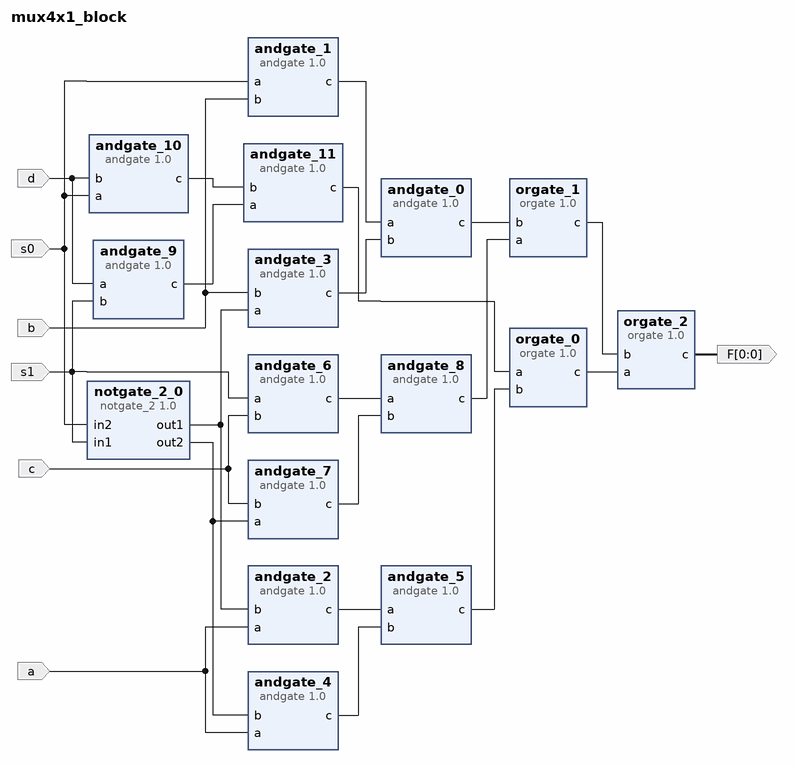
[diagram p0: block diagram of the top level]
# Vivado block design mux4x1_block, xc7a35tcpg236-1, Vivado 2018.3
create_bd_design mux4x1_block

create_bd_port -dir I s1
create_bd_port -dir I s0
create_bd_port -dir I a
create_bd_port -dir I b
create_bd_port -dir I c
create_bd_port -dir I d
create_bd_port -dir O -from 0 -to 0 F

create_bd_cell -type ip -vlnv xilinx.com:user:notgate_2:1.0 notgate_2_0
create_bd_cell -type ip -vlnv xilinx.com:user:andgate:1.0 andgate_0
create_bd_cell -type ip -vlnv xilinx.com:user:andgate:1.0 andgate_1
create_bd_cell -type ip -vlnv xilinx.com:user:andgate:1.0 andgate_2
create_bd_cell -type ip -vlnv xilinx.com:user:andgate:1.0 andgate_3
create_bd_cell -type ip -vlnv xilinx.com:user:orgate:1.0 orgate_0
create_bd_cell -type ip -vlnv xilinx.com:user:orgate:1.0 orgate_1
create_bd_cell -type ip -vlnv xilinx.com:user:andgate:1.0 andgate_4
create_bd_cell -type ip -vlnv xilinx.com:user:andgate:1.0 andgate_5
create_bd_cell -type ip -vlnv xilinx.com:user:andgate:1.0 andgate_6
create_bd_cell -type ip -vlnv xilinx.com:user:andgate:1.0 andgate_7
create_bd_cell -type ip -vlnv xilinx.com:user:andgate:1.0 andgate_8
create_bd_cell -type ip -vlnv xilinx.com:user:andgate:1.0 andgate_9
create_bd_cell -type ip -vlnv xilinx.com:user:andgate:1.0 andgate_10
create_bd_cell -type ip -vlnv xilinx.com:user:andgate:1.0 andgate_11
create_bd_cell -type ip -vlnv xilinx.com:user:orgate:1.0 orgate_2

# ---- connections ----

connect_bd_net -net s1_1 [get_bd_ports s1] [get_bd_pins notgate_2_0/in1] [get_bd_pins andgate_6/a] [get_bd_pins andgate_9/b]
connect_bd_net [get_bd_ports a] [get_bd_pins andgate_2/a] [get_bd_pins andgate_4/a]
connect_bd_net [get_bd_pins notgate_2_0/out1] [get_bd_pins andgate_2/b] [get_bd_pins andgate_3/a]
connect_bd_net [get_bd_pins notgate_2_0/out2] [get_bd_pins andgate_4/b] [get_bd_pins andgate_7/a]
connect_bd_net [get_bd_pins andgate_2/c] [get_bd_pins andgate_5/a]
connect_bd_net [get_bd_pins andgate_4/c] [get_bd_pins andgate_5/b]
connect_bd_net [get_bd_ports b] [get_bd_pins andgate_3/b] [get_bd_pins andgate_1/b]
connect_bd_net -net s0_1 [get_bd_ports s0] [get_bd_pins notgate_2_0/in2] [get_bd_pins andgate_1/a] [get_bd_pins andgate_10/a]
connect_bd_net [get_bd_pins andgate_1/c] [get_bd_pins andgate_0/a]
connect_bd_net [get_bd_pins andgate_3/c] [get_bd_pins andgate_0/b]
connect_bd_net [get_bd_ports c] [get_bd_pins andgate_7/b] [get_bd_pins andgate_6/b]
connect_bd_net [get_bd_pins andgate_6/c] [get_bd_pins andgate_8/a]
connect_bd_net [get_bd_pins andgate_7/c] [get_bd_pins andgate_8/b]
connect_bd_net [get_bd_ports d] [get_bd_pins andgate_9/a] [get_bd_pins andgate_10/b]
connect_bd_net [get_bd_pins andgate_9/c] [get_bd_pins andgate_11/a]
connect_bd_net [get_bd_pins andgate_10/c] [get_bd_pins andgate_11/b]
connect_bd_net [get_bd_pins andgate_11/c] [get_bd_pins orgate_0/a]
connect_bd_net [get_bd_pins andgate_5/c] [get_bd_pins orgate_0/b]
connect_bd_net [get_bd_pins andgate_8/c] [get_bd_pins orgate_1/a]
connect_bd_net [get_bd_pins andgate_0/c] [get_bd_pins orgate_1/b]
connect_bd_net [get_bd_pins orgate_0/c] [get_bd_pins orgate_2/a]
connect_bd_net [get_bd_pins orgate_1/c] [get_bd_pins orgate_2/b]
connect_bd_net [get_bd_pins orgate_2/c] [get_bd_ports F]

validate_bd_design
save_bd_design
